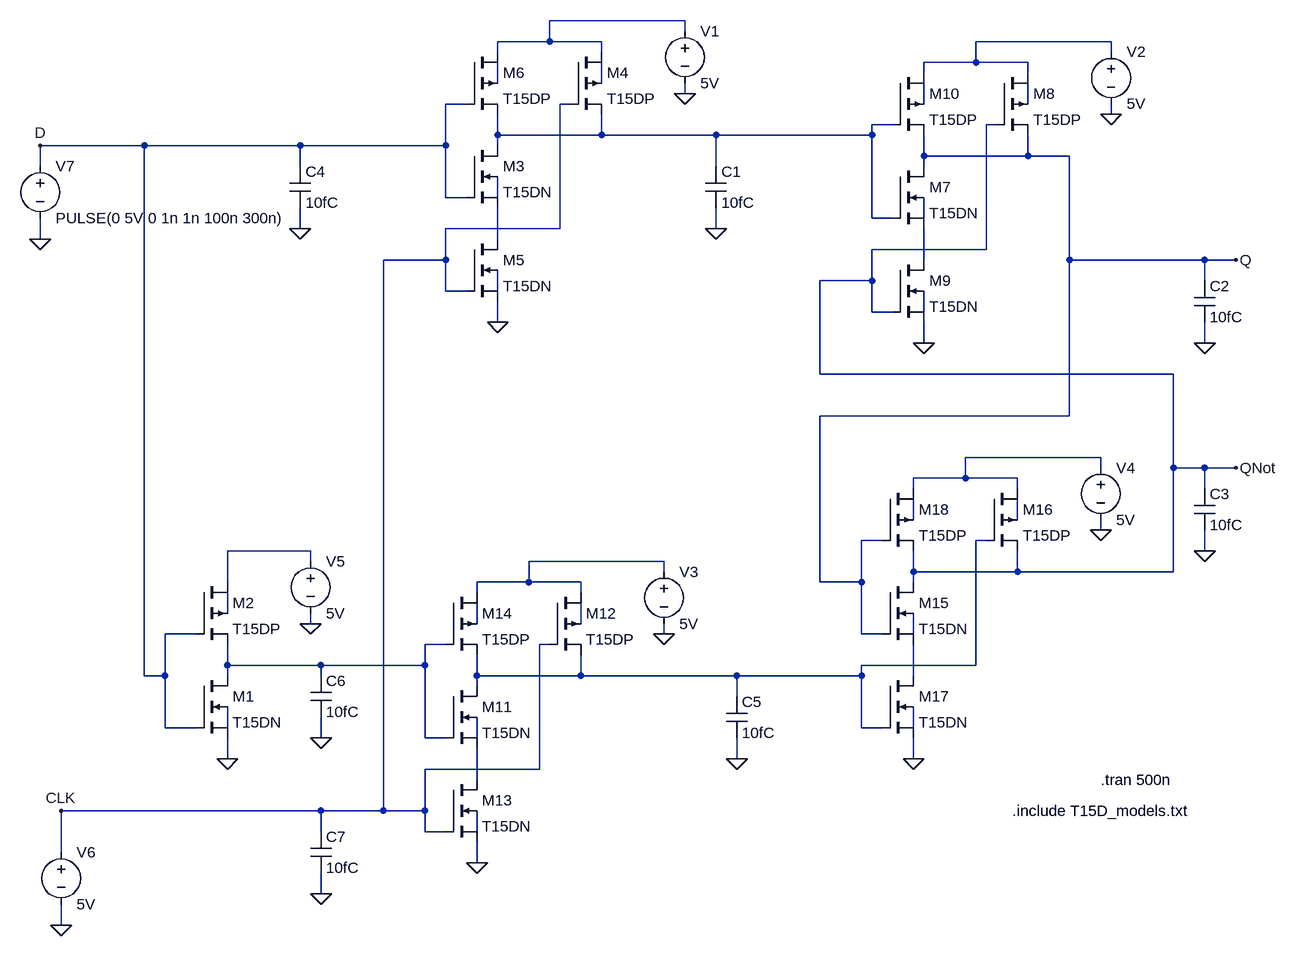
[diagram p0: schematic ehb322e_hw3.asc]
ehb322e_hw3.asc, the LTspice schematic file:
Version 4
SHEET 1 1236 824
WIRE 304 -704 96 -704
WIRE 304 -688 304 -704
WIRE 96 -672 96 -704
WIRE 96 -672 16 -672
WIRE 176 -672 96 -672
WIRE 960 -672 752 -672
WIRE 16 -656 16 -672
WIRE 176 -656 176 -672
WIRE 960 -656 960 -672
WIRE 752 -640 752 -672
WIRE 752 -640 672 -640
WIRE 832 -640 752 -640
WIRE 672 -624 672 -640
WIRE 832 -624 832 -640
WIRE 16 -608 16 -640
WIRE 176 -608 176 -640
WIRE 304 -592 304 -608
WIRE -32 -576 -64 -576
WIRE 128 -576 112 -576
WIRE 672 -576 672 -608
WIRE 832 -576 832 -608
WIRE 960 -560 960 -576
WIRE 624 -544 592 -544
WIRE 784 -544 768 -544
WIRE 16 -528 16 -560
WIRE 176 -528 176 -560
WIRE 176 -528 16 -528
WIRE 352 -528 176 -528
WIRE 592 -528 592 -544
WIRE 592 -528 352 -528
WIRE -528 -512 -688 -512
WIRE -288 -512 -528 -512
WIRE -64 -512 -64 -576
WIRE -64 -512 -288 -512
WIRE 16 -512 16 -528
WIRE 672 -496 672 -528
WIRE 832 -496 832 -528
WIRE 832 -496 672 -496
WIRE 896 -496 832 -496
WIRE -688 -480 -688 -512
WIRE -288 -480 -288 -512
WIRE 352 -480 352 -528
WIRE 672 -480 672 -496
WIRE -64 -432 -64 -512
WIRE -32 -432 -64 -432
WIRE 16 -432 16 -464
WIRE 592 -400 592 -528
WIRE 624 -400 592 -400
WIRE 672 -400 672 -432
WIRE -288 -384 -288 -416
WIRE 112 -384 112 -576
WIRE 112 -384 -64 -384
WIRE 352 -384 352 -416
WIRE -688 -368 -688 -400
WIRE 16 -368 16 -416
WIRE 768 -352 768 -544
WIRE 768 -352 592 -352
WIRE -64 -336 -64 -384
WIRE -64 -336 -160 -336
WIRE 672 -336 672 -384
WIRE 896 -336 896 -496
WIRE 1104 -336 896 -336
WIRE 1152 -336 1104 -336
WIRE 592 -304 592 -352
WIRE 592 -304 512 -304
WIRE 1104 -304 1104 -336
WIRE -64 -288 -64 -336
WIRE -32 -288 -64 -288
WIRE 16 -288 16 -320
WIRE 592 -256 592 -304
WIRE 624 -256 592 -256
WIRE 672 -256 672 -288
WIRE 16 -240 16 -272
WIRE 672 -208 672 -240
WIRE 1104 -208 1104 -240
WIRE 512 -160 512 -304
WIRE 1056 -160 512 -160
WIRE 896 -96 896 -336
WIRE 896 -96 512 -96
WIRE 944 -32 736 -32
WIRE 944 -16 944 -32
WIRE 1056 -16 1056 -160
WIRE 1104 -16 1056 -16
WIRE 1152 -16 1104 -16
WIRE 736 0 736 -32
WIRE 736 0 656 0
WIRE 816 0 736 0
WIRE 656 16 656 0
WIRE 816 16 816 0
WIRE 1104 16 1104 -16
WIRE 656 64 656 32
WIRE 816 64 816 32
WIRE 944 80 944 64
WIRE 608 96 576 96
WIRE 768 96 752 96
WIRE -272 112 -400 112
WIRE 1104 112 1104 80
WIRE -272 128 -272 112
WIRE 272 128 64 128
WIRE 272 144 272 128
WIRE 656 144 656 112
WIRE 816 144 816 112
WIRE 816 144 656 144
WIRE 1056 144 1056 -16
WIRE 1056 144 816 144
WIRE -400 160 -400 112
WIRE 64 160 64 128
WIRE 64 160 -16 160
WIRE 144 160 64 160
WIRE 512 160 512 -96
WIRE 576 160 576 96
WIRE 576 160 512 160
WIRE 656 160 656 144
WIRE -16 176 -16 160
WIRE 144 176 144 160
WIRE -400 208 -400 176
WIRE -272 224 -272 208
WIRE -16 224 -16 192
WIRE 144 224 144 192
WIRE -448 240 -496 240
WIRE 272 240 272 224
WIRE 576 240 576 160
WIRE 608 240 576 240
WIRE 656 240 656 208
WIRE -64 256 -96 256
WIRE 96 256 80 256
WIRE -400 288 -400 256
WIRE -256 288 -400 288
WIRE -96 288 -96 256
WIRE -96 288 -256 288
WIRE 752 288 752 96
WIRE 752 288 576 288
WIRE -528 304 -528 -512
WIRE -496 304 -496 240
WIRE -496 304 -528 304
WIRE -400 304 -400 288
WIRE -256 304 -256 288
WIRE -16 304 -16 272
WIRE 144 304 144 272
WIRE 144 304 -16 304
WIRE 384 304 144 304
WIRE 576 304 576 288
WIRE 576 304 384 304
WIRE 656 304 656 256
WIRE -16 320 -16 304
WIRE 384 336 384 304
WIRE -496 384 -496 304
WIRE -448 384 -496 384
WIRE -400 384 -400 352
WIRE 576 384 576 304
WIRE 608 384 576 384
WIRE 656 384 656 352
WIRE -256 400 -256 368
WIRE -96 400 -96 288
WIRE -64 400 -96 400
WIRE -16 400 -16 368
WIRE -400 432 -400 400
WIRE 384 432 384 400
WIRE 656 432 656 400
WIRE 80 448 80 256
WIRE 80 448 -96 448
WIRE -16 464 -16 416
WIRE -256 512 -656 512
WIRE -160 512 -160 -336
WIRE -160 512 -256 512
WIRE -96 512 -96 448
WIRE -96 512 -160 512
WIRE -256 544 -256 512
WIRE -96 544 -96 512
WIRE -64 544 -96 544
WIRE -16 544 -16 512
WIRE -656 576 -656 512
WIRE -16 592 -16 560
WIRE -256 640 -256 608
WIRE -656 688 -656 656
FLAG 16 -240 0
FLAG 304 -592 0
FLAG -400 432 0
FLAG -272 224 0
FLAG 672 -208 0
FLAG 960 -560 0
FLAG -16 592 0
FLAG 272 240 0
FLAG 656 432 0
FLAG 944 80 0
FLAG -688 -368 0
FLAG -656 688 0
FLAG -688 -512 D
FLAG -656 512 CLK
FLAG 1152 -336 Q
FLAG 1152 -16 QNot
FLAG -288 -384 0
FLAG 352 -384 0
FLAG 1104 -208 0
FLAG 1104 112 0
FLAG 384 432 0
FLAG -256 400 0
FLAG -256 640 0
SYMBOL nmos4 -448 304 R0
SYMATTR InstName M1
SYMATTR Value T15DN
SYMATTR Value2 l=1u w=1u
SYMBOL pmos4 -448 160 R0
SYMATTR InstName M2
SYMATTR Value T15DP
SYMATTR Value2 l=1u w=1u
SYMBOL voltage 304 -704 R0
WINDOW 123 0 0 Left 2
WINDOW 39 0 0 Left 2
SYMATTR InstName V1
SYMATTR Value 5V
SYMBOL nmos4 -32 -512 R0
SYMATTR InstName M3
SYMATTR Value T15DN
SYMATTR Value2 l=1u w=1u
SYMBOL pmos4 128 -656 R0
SYMATTR InstName M4
SYMATTR Value T15DP
SYMATTR Value2 l=1u w=1u
SYMBOL nmos4 -32 -368 R0
SYMATTR InstName M5
SYMATTR Value T15DN
SYMATTR Value2 l=1u w=1u
SYMBOL pmos4 -32 -656 R0
SYMATTR InstName M6
SYMATTR Value T15DP
SYMATTR Value2 l=1u w=1u
SYMBOL voltage -272 112 R0
WINDOW 123 0 0 Left 2
WINDOW 39 0 0 Left 2
SYMATTR InstName V5
SYMATTR Value 5V
SYMBOL voltage 960 -672 R0
WINDOW 123 0 0 Left 2
WINDOW 39 0 0 Left 2
SYMATTR InstName V2
SYMATTR Value 5V
SYMBOL nmos4 624 -480 R0
SYMATTR InstName M7
SYMATTR Value T15DN
SYMATTR Value2 l=1u w=1u
SYMBOL pmos4 784 -624 R0
SYMATTR InstName M8
SYMATTR Value T15DP
SYMATTR Value2 l=1u w=1u
SYMBOL nmos4 624 -336 R0
SYMATTR InstName M9
SYMATTR Value T15DN
SYMATTR Value2 l=1u w=1u
SYMBOL pmos4 624 -624 R0
SYMATTR InstName M10
SYMATTR Value T15DP
SYMATTR Value2 l=1u w=1u
SYMBOL voltage 272 128 R0
WINDOW 123 0 0 Left 2
WINDOW 39 0 0 Left 2
SYMATTR InstName V3
SYMATTR Value 5V
SYMBOL nmos4 -64 320 R0
SYMATTR InstName M11
SYMATTR Value T15DN
SYMATTR Value2 l=1u w=1u
SYMBOL pmos4 96 176 R0
SYMATTR InstName M12
SYMATTR Value T15DP
SYMATTR Value2 l=1u w=1u
SYMBOL nmos4 -64 464 R0
SYMATTR InstName M13
SYMATTR Value T15DN
SYMATTR Value2 l=1u w=1u
SYMBOL pmos4 -64 176 R0
SYMATTR InstName M14
SYMATTR Value T15DP
SYMATTR Value2 l=1u w=1u
SYMBOL voltage 944 -32 R0
WINDOW 123 0 0 Left 2
WINDOW 39 0 0 Left 2
SYMATTR InstName V4
SYMATTR Value 5V
SYMBOL nmos4 608 160 R0
SYMATTR InstName M15
SYMATTR Value T15DN
SYMATTR Value2 l=1u w=1u
SYMBOL pmos4 768 16 R0
SYMATTR InstName M16
SYMATTR Value T15DP
SYMATTR Value2 l=1u w=1u
SYMBOL nmos4 608 304 R0
SYMATTR InstName M17
SYMATTR Value T15DN
SYMATTR Value2 l=1u w=1u
SYMBOL pmos4 608 16 R0
SYMATTR InstName M18
SYMATTR Value T15DP
SYMATTR Value2 l=1u w=1u
SYMBOL voltage -688 -496 R0
WINDOW 123 0 0 Left 2
WINDOW 39 0 0 Left 2
SYMATTR InstName V7
SYMATTR Value PULSE(0 5V 0 1n 1n 100n 300n)
SYMBOL voltage -656 560 R0
WINDOW 123 0 0 Left 2
WINDOW 39 0 0 Left 2
SYMATTR InstName V6
SYMATTR Value 5V
SYMBOL cap -304 -480 R0
SYMATTR InstName C4
SYMATTR Value 10fC
SYMBOL cap 336 -480 R0
SYMATTR InstName C1
SYMATTR Value 10fC
SYMBOL cap 1088 -304 R0
SYMATTR InstName C2
SYMATTR Value 10fC
SYMBOL cap 1088 16 R0
SYMATTR InstName C3
SYMATTR Value 10fC
SYMBOL cap 368 336 R0
SYMATTR InstName C5
SYMATTR Value 10fC
SYMBOL cap -272 304 R0
SYMATTR InstName C6
SYMATTR Value 10fC
SYMBOL cap -272 544 R0
SYMATTR InstName C7
SYMATTR Value 10fC
TEXT 808 512 Left 2 !.include T15D_models.txt
TEXT 944 464 Left 2 !.tran 500n

The netlist it stands for:
* ehb322e_hw3.asc
M1 N024 D 0 N026 T15DN l=1u w=1u
M2 N018 D N024 N020 T15DP l=1u w=1u
V1 N001 0 5V
M3 N007 D N010 N008 T15DN l=1u w=1u
M4 N001 CLK N007 N004 T15DP l=1u w=1u
M5 N010 CLK 0 N012 T15DN l=1u w=1u
M6 N001 D N007 N003 T15DP l=1u w=1u
V5 N018 0 5V
V2 N002 0 5V
M7 Q N007 N011 N009 T15DN l=1u w=1u
M8 N002 QNot Q N006 T15DP l=1u w=1u
M9 N011 QNot 0 N013 T15DN l=1u w=1u
M10 N002 N007 Q N005 T15DP l=1u w=1u
V3 N019 0 5V
M11 N017 N024 N029 N028 T15DN l=1u w=1u
M12 N019 CLK N017 N022 T15DP l=1u w=1u
M13 N029 CLK 0 N030 T15DN l=1u w=1u
M14 N019 N024 N017 N021 T15DP l=1u w=1u
V4 N014 0 5V
M15 QNot Q N025 N023 T15DN l=1u w=1u
M16 N014 N017 QNot N016 T15DP l=1u w=1u
M17 N025 N017 0 N027 T15DN l=1u w=1u
M18 N014 Q QNot N015 T15DP l=1u w=1u
V7 D 0 PULSE(0 5V 0 1n 1n 100n 300n)
V6 CLK 0 5V
C4 D 0 10fC
C1 N007 0 10fC
C2 Q 0 10fC
C3 QNot 0 10fC
C5 N017 0 10fC
C6 N024 0 10fC
C7 CLK 0 10fC
.model NMOS NMOS
.model PMOS PMOS
.lib standard.mos
.include T15D_models.txt
.tran 500n
.backanno
.end